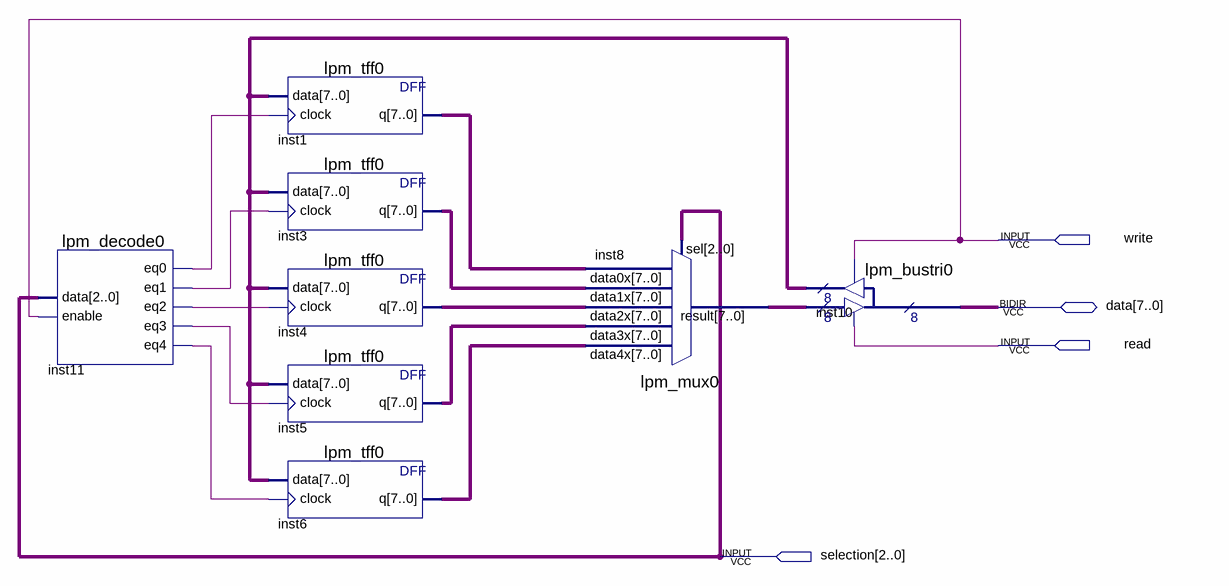
[diagram p0: schematic sheet]
// Quartus schematic Bufer.bdf as structural Verilog: 8 symbols, 4 pins
module Bufer (
  input  write,
  input  read,
  input  [2:0] selection,
  inout  [7:0] data
);

  wire inst11_eq0, inst11_eq1, inst11_eq2, inst11_eq3, inst11_eq4;
  wire [7:0] inst1_q, inst3_q, inst4_q, inst5_q, inst6_q, inst8_result, inst10_result;

  lpm_decode0 inst11 (
    .data(selection), .enable(write), .eq0(inst11_eq0), .eq1(inst11_eq1), .eq2(inst11_eq2), .eq3(inst11_eq3),
    .eq4(inst11_eq4));
  lpm_tff0 inst1 (.data(inst10_result), .clock(inst11_eq0), .q(inst1_q));
  lpm_tff0 inst3 (.data(inst10_result), .clock(inst11_eq1), .q(inst3_q));
  lpm_tff0 inst4 (.data(inst10_result), .clock(inst11_eq2), .q(inst4_q));
  lpm_tff0 inst5 (.data(inst10_result), .clock(inst11_eq3), .q(inst5_q));
  lpm_tff0 inst6 (.data(inst10_result), .clock(inst11_eq4), .q(inst6_q));
  lpm_mux0 inst8 (
    .data4x(inst6_q), .data3x(inst5_q), .data2x(inst4_q), .data1x(inst3_q), .data0x(inst1_q),
    .sel(selection), .result(inst8_result));
  lpm_bustri0 inst10 (.enabledt(read), .data(inst8_result), .enabletr(write), .result(inst10_result), .tridata(data));
endmodule
